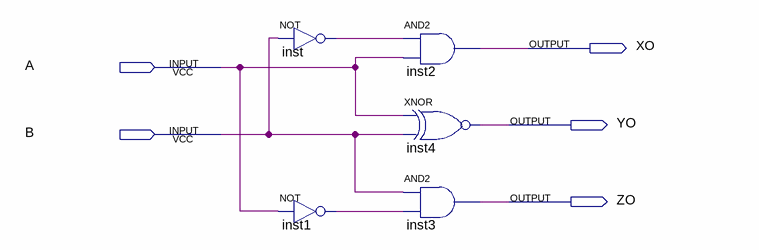
[diagram p0: schematic sheet]
// Quartus schematic onebitcomparator_sime.bdf as structural Verilog: 5 symbols, 5 pins
module onebitcomparator_sime (
  input  A,
  input  B,
  output XO,
  output YO,
  output ZO
);

  wire inst1_out, inst_out;

  not inst (inst_out, B);
  not inst1 (inst1_out, A);
  and inst2 (XO, inst_out, A);
  xnor inst4 (YO, A, B);
  and inst3 (ZO, B, inst1_out);
endmodule
